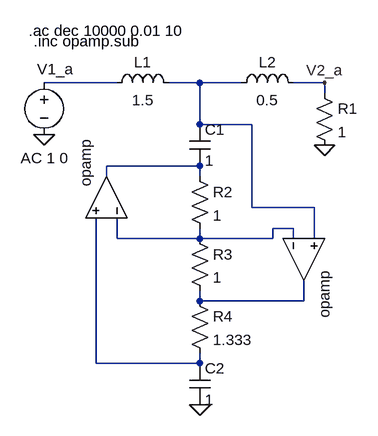
[diagram p0: schematic P4.asc]
P4.asc, the LTspice schematic file:
Version 4
SHEET 1 952 680
WIRE 48 128 -64 128
WIRE 176 128 128 128
WIRE 240 128 176 128
WIRE 368 128 320 128
WIRE 368 144 368 128
WIRE 176 192 176 128
WIRE 256 192 176 192
WIRE 176 256 32 256
WIRE 32 272 32 256
WIRE 176 272 176 256
WIRE 256 320 256 192
WIRE 352 320 256 320
WIRE 320 352 288 352
WIRE 48 368 48 336
WIRE 176 368 176 352
WIRE 176 368 48 368
WIRE 288 368 288 352
WIRE 288 368 176 368
WIRE 320 368 320 352
WIRE 352 368 352 320
WIRE 176 464 176 448
WIRE 336 464 336 432
WIRE 336 464 176 464
WIRE 16 560 16 336
WIRE 176 560 176 544
WIRE 176 560 16 560
FLAG 368 224 0
FLAG -64 208 0
FLAG 368 128 V2_a
FLAG 176 624 0
SYMBOL ind 32 144 R270
WINDOW 0 32 56 VTop 2
WINDOW 3 5 56 VBottom 2
SYMATTR InstName L1
SYMATTR Value 1.5
SYMBOL ind 224 144 R270
WINDOW 0 32 56 VTop 2
WINDOW 3 5 56 VBottom 2
SYMATTR InstName L2
SYMATTR Value 0.5
SYMBOL res 352 128 R0
SYMATTR InstName R1
SYMATTR Value 1
SYMBOL voltage -64 112 R0
WINDOW 0 -11 -5 Left 2
WINDOW 3 -62 62 Left 2
WINDOW 123 -36 132 Left 2
WINDOW 39 0 0 Left 0
SYMATTR InstName V1_a
SYMATTR Value ""
SYMATTR Value2 AC 1 0
SYMBOL cap 160 192 R0
SYMATTR InstName C1
SYMATTR Value 1
SYMBOL res 160 256 R0
SYMATTR InstName R2
SYMATTR Value 1
SYMBOL res 160 352 R0
SYMATTR InstName R3
SYMATTR Value 1
SYMBOL res 160 448 R0
SYMATTR InstName R4
SYMATTR Value 1.333
SYMBOL cap 160 560 R0
SYMATTR InstName C2
SYMATTR Value 1
SYMBOL Opamps\\opamp 272 400 M90
WINDOW 0 0 32 Invisible 2
SYMATTR InstName U1
SYMBOL Opamps\\opamp 96 304 M270
WINDOW 0 0 32 Invisible 2
SYMATTR InstName U2
TEXT -88 48 Left 2 !.ac dec 10000 0.01 10
TEXT -80 64 Left 2 !.inc opamp.sub

The netlist it stands for:
* P4.asc
L1 N001 N002 1.5
L2 N002 V2_a 0.5
R1 V2_a 0 1
V1_a N001 0 AC 1 0
C1 N002 N003 1
R2 N003 N004 1
R3 N004 N005 1
R4 N005 N006 1.333
C2 N006 0 1
XU1 N004 N002 N005 opamp Aol=100K GBW=10Meg  ; pins invin noninvin out
XU2 N004 N006 N003 opamp Aol=100K GBW=10Meg  ; pins invin noninvin out
.ac dec 10000 0.01 10
.inc opamp.sub
.backanno
.end